# EAGLE schematic tick-mk-1.1 (EAGLE 6.5.0)
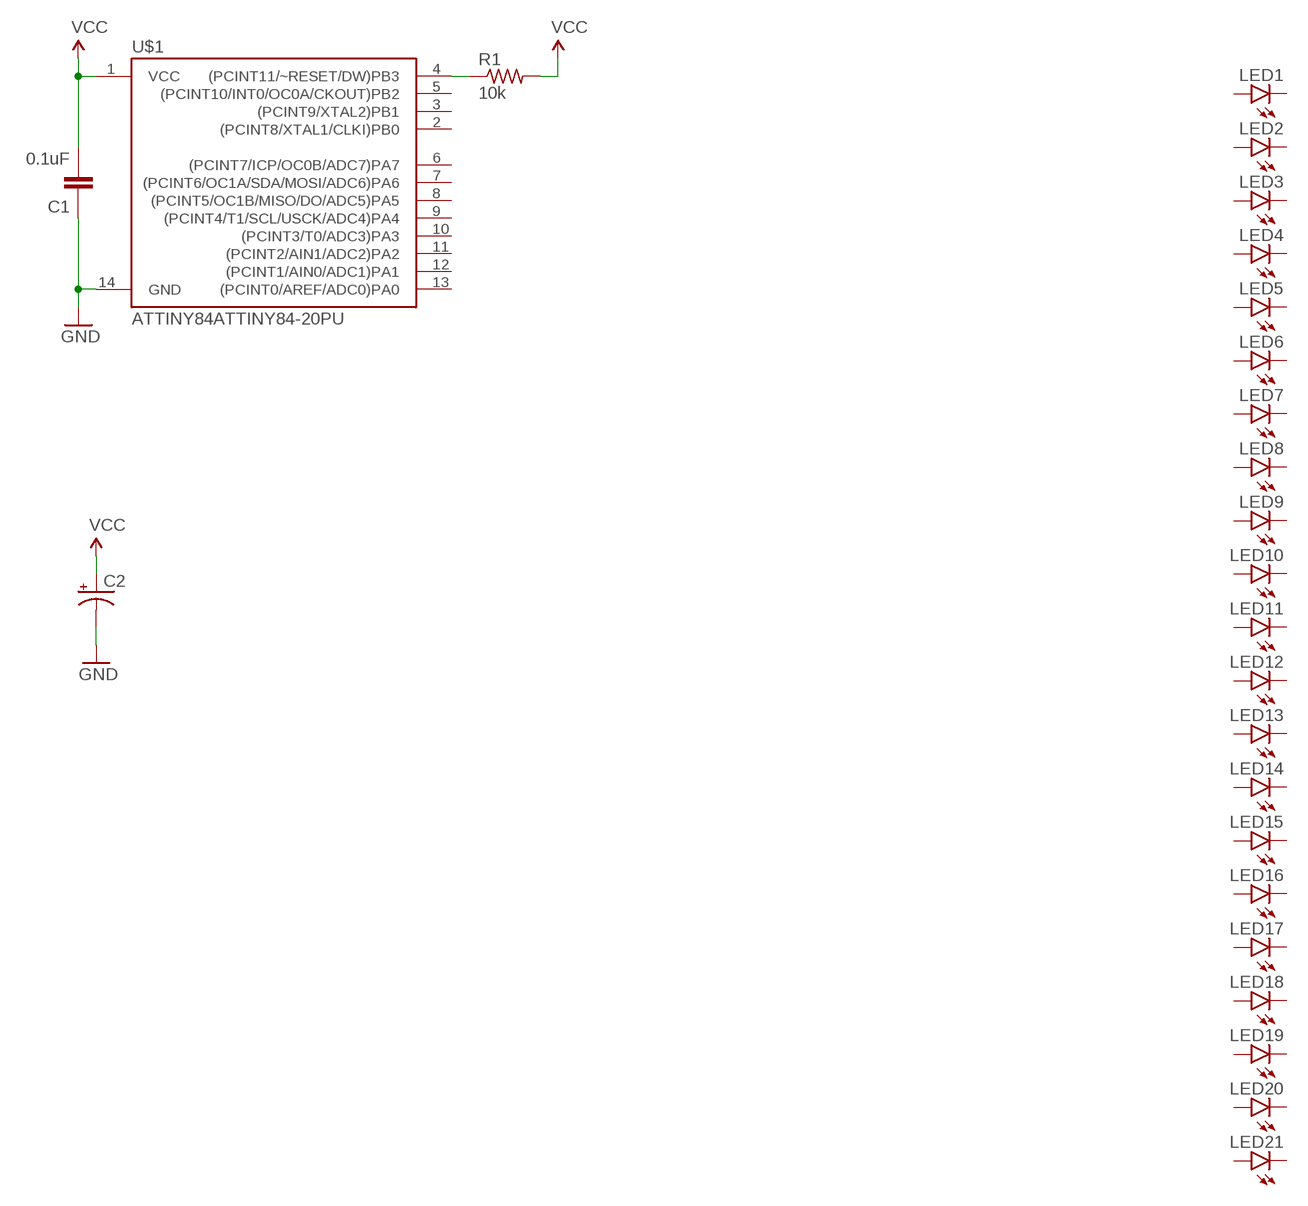
[diagram p0: schematic, sheet 1]

## Parts
C1  0.1uF  CAPACITOR-CERAMIC025-024X044  [C025-024X044]
C2  CAPACITOR-POLARIZEDE2-5  [E2-5]
LED1  LED5MM_SHORTPADS  [LED5MM_SHORTPADS]
LED2  LED5MM_SHORTPADS  [LED5MM_SHORTPADS]
LED3  LED5MM_SHORTPADS  [LED5MM_SHORTPADS]
LED4  LED5MM_SHORTPADS  [LED5MM_SHORTPADS]
LED5  LED5MM_SHORTPADS  [LED5MM_SHORTPADS]
LED6  LED5MM_SHORTPADS  [LED5MM_SHORTPADS]
LED7  LED5MM_SHORTPADS  [LED5MM_SHORTPADS]
LED8  LED5MM_SHORTPADS  [LED5MM_SHORTPADS]
LED9  LED5MM_SHORTPADS  [LED5MM_SHORTPADS]
LED10  LED5MM_SHORTPADS  [LED5MM_SHORTPADS]
LED11  LED5MM_SHORTPADS  [LED5MM_SHORTPADS]
LED12  LED5MM_SHORTPADS  [LED5MM_SHORTPADS]
LED13  LED5MM_SHORTPADS  [LED5MM_SHORTPADS]
LED14  LED5MM_SHORTPADS  [LED5MM_SHORTPADS]
LED15  LED5MM_SHORTPADS  [LED5MM_SHORTPADS]
LED16  LED5MM_SHORTPADS  [LED5MM_SHORTPADS]
LED17  LED5MM_SHORTPADS  [LED5MM_SHORTPADS]
LED18  LED5MM_SHORTPADS  [LED5MM_SHORTPADS]
LED19  LED5MM_SHORTPADS  [LED5MM_SHORTPADS]
LED20  LED5MM_SHORTPADS  [LED5MM_SHORTPADS]
LED21  LED5MM_SHORTPADS  [LED5MM_SHORTPADS]
R1  10k  RESISTORPTH-AXIAL-5.08MM  [RESISTOR-AXIAL-PTH-5.08MM]
U$1  ATTINY84ATTINY84-20PU  [DIL14]

## Nets
GND: C1.1 C2.- U$1.14(GND)
N$1: R1.P$1 U$1.4((PCINT11/~RESET/DW)PB3)
VCC: C1.2 C2.+ R1.P$2 U$1.1(VCC)
Unconnected: LED1.A LED1.K(C) LED2.A LED2.K(C) LED3.A LED3.K(C) LED4.A LED4.K(C) LED5.A LED5.K(C) LED6.A LED6.K(C) LED7.A LED7.K(C) LED8.A LED8.K(C) LED9.A LED9.K(C) LED10.A LED10.K(C) LED11.A LED11.K(C) LED12.A LED12.K(C) LED13.A LED13.K(C) LED14.A LED14.K(C) LED15.A LED15.K(C) LED16.A LED16.K(C) LED17.A LED17.K(C) LED18.A LED18.K(C) LED19.A LED19.K(C) LED20.A LED20.K(C) LED21.A LED21.K(C) U$1.2((PCINT8/XTAL1/CLKI)PB0) U$1.3((PCINT9/XTAL2)PB1) U$1.5((PCINT10/INT0/OC0A/CKOUT)PB2) U$1.6((PCINT7/ICP/OC0B/ADC7)PA7) U$1.7((PCINT6/OC1A/SDA/MOSI/ADC6)PA6) U$1.8((PCINT5/OC1B/MISO/DO/ADC5)PA5) U$1.9((PCINT4/T1/SCL/USCK/ADC4)PA4) U$1.10((PCINT3/T0/ADC3)PA3) U$1.11((PCINT2/AIN1/ADC2)PA2) U$1.12((PCINT1/AIN0/ADC1)PA1) U$1.13((PCINT0/AREF/ADC0)PA0)

## Library data of the parts
C1 = A_butts:CAPACITOR-CERAMIC: CAPACITOR, European symbol
C2 = A_butts:CAPACITOR-POLARIZED: POLARIZED CAPACITOR, American symbol
LED1-LED21 = A_butts:LED: LEDs Standard schematic elements and footprints for 5mm, 3mm, 1206, and 0603 sized LEDs. 5mm - Spark Fun Electronics SKU : COM-00529 (and others)
R1 = A_butts:RESISTOR: RESISTOR, American symbol
U$1 = A_butts:ATTINY84: Atmel 14-pin 2/4/8kB flash uC